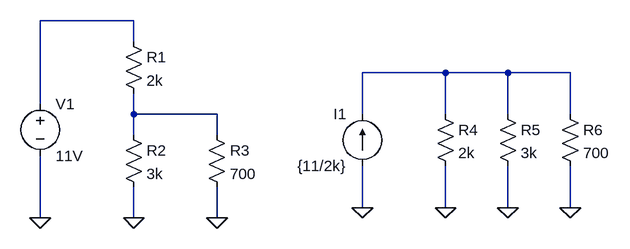
[diagram p0: schematic Draft9.asc]
Draft9.asc, the LTspice schematic file:
Version 4
SHEET 1 1092 680
WIRE 0 32 -144 32
WIRE 0 64 0 32
WIRE 480 112 352 112
WIRE 576 112 480 112
WIRE 672 112 576 112
WIRE -144 160 -144 32
WIRE 0 176 0 144
WIRE 128 176 0 176
WIRE 352 176 352 112
WIRE 480 176 480 112
WIRE 576 176 576 112
WIRE 672 176 672 112
WIRE 0 208 0 176
WIRE 128 208 128 176
WIRE 352 320 352 256
WIRE 480 320 480 256
WIRE 576 320 576 256
WIRE 672 320 672 256
WIRE -144 336 -144 240
WIRE 0 336 0 288
WIRE 128 336 128 288
FLAG -144 336 0
FLAG 0 336 0
FLAG 128 336 0
FLAG 352 320 0
FLAG 480 320 0
FLAG 576 320 0
FLAG 672 320 0
SYMBOL res -16 48 R0
SYMATTR InstName R1
SYMATTR Value 2k
SYMBOL res -16 192 R0
SYMATTR InstName R2
SYMATTR Value 3k
SYMBOL res 112 192 R0
SYMATTR InstName R3
SYMATTR Value 700
SYMBOL voltage -144 144 R0
WINDOW 123 0 0 Left 2
WINDOW 39 0 0 Left 2
SYMATTR InstName V1
SYMATTR Value 11V
SYMBOL current 352 256 R180
WINDOW 0 24 80 Left 2
WINDOW 3 24 0 Left 2
SYMATTR InstName I1
SYMATTR Value {11/2k}
SYMBOL res 464 160 R0
SYMATTR InstName R4
SYMATTR Value 2k
SYMBOL res 560 160 R0
SYMATTR InstName R5
SYMATTR Value 3k
SYMBOL res 656 160 R0
SYMATTR InstName R6
SYMATTR Value 700

The netlist it stands for:
* Draft9.asc
R1 N001 N003 2k
R2 N003 0 3k
R3 N003 0 700
V1 N001 0 11V
I1 0 N002 {11/2k}
R4 N002 0 2k
R5 N002 0 3k
R6 N002 0 700
.backanno
.end